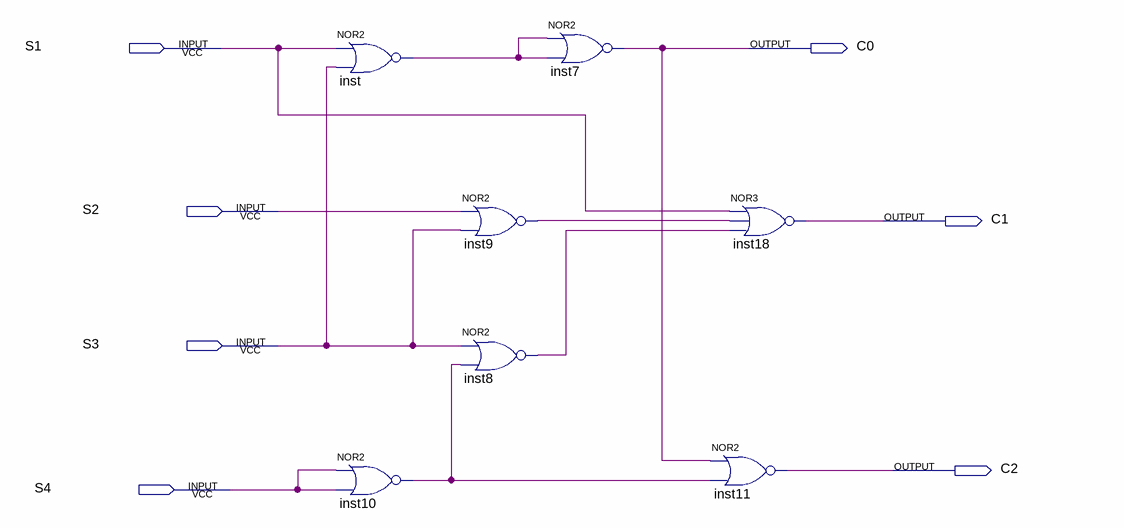
[diagram p0: schematic sheet]
// Quartus schematic coderLift_nda2_1.bdf as structural Verilog: 7 symbols, 7 pins
module coderLift_nda2_1 (
  input  S1,
  input  S2,
  input  S3,
  input  S4,
  output C0,
  output C1,
  output C2
);

  wire inst8_out, inst9_out, inst10_out, inst_out;

  nor inst (inst_out, S1, S3);
  nor inst10 (inst10_out, S4, S4);
  nor inst9 (inst9_out, S2, S3);
  nor inst8 (inst8_out, S3, inst10_out);
  nor inst7 (C0, inst_out, inst_out);
  nor inst18 (C1, S1, inst9_out, inst8_out);
  nor inst11 (C2, C0, inst10_out);
endmodule
